# EasyEDA schematic CoffeePID_EDA.json

## Sheets
1 Wemos D1: TITLE: Sheet_1; REV: 1.0; Date: 2022-12-23; Sheet: 1/1; Company: Your Company
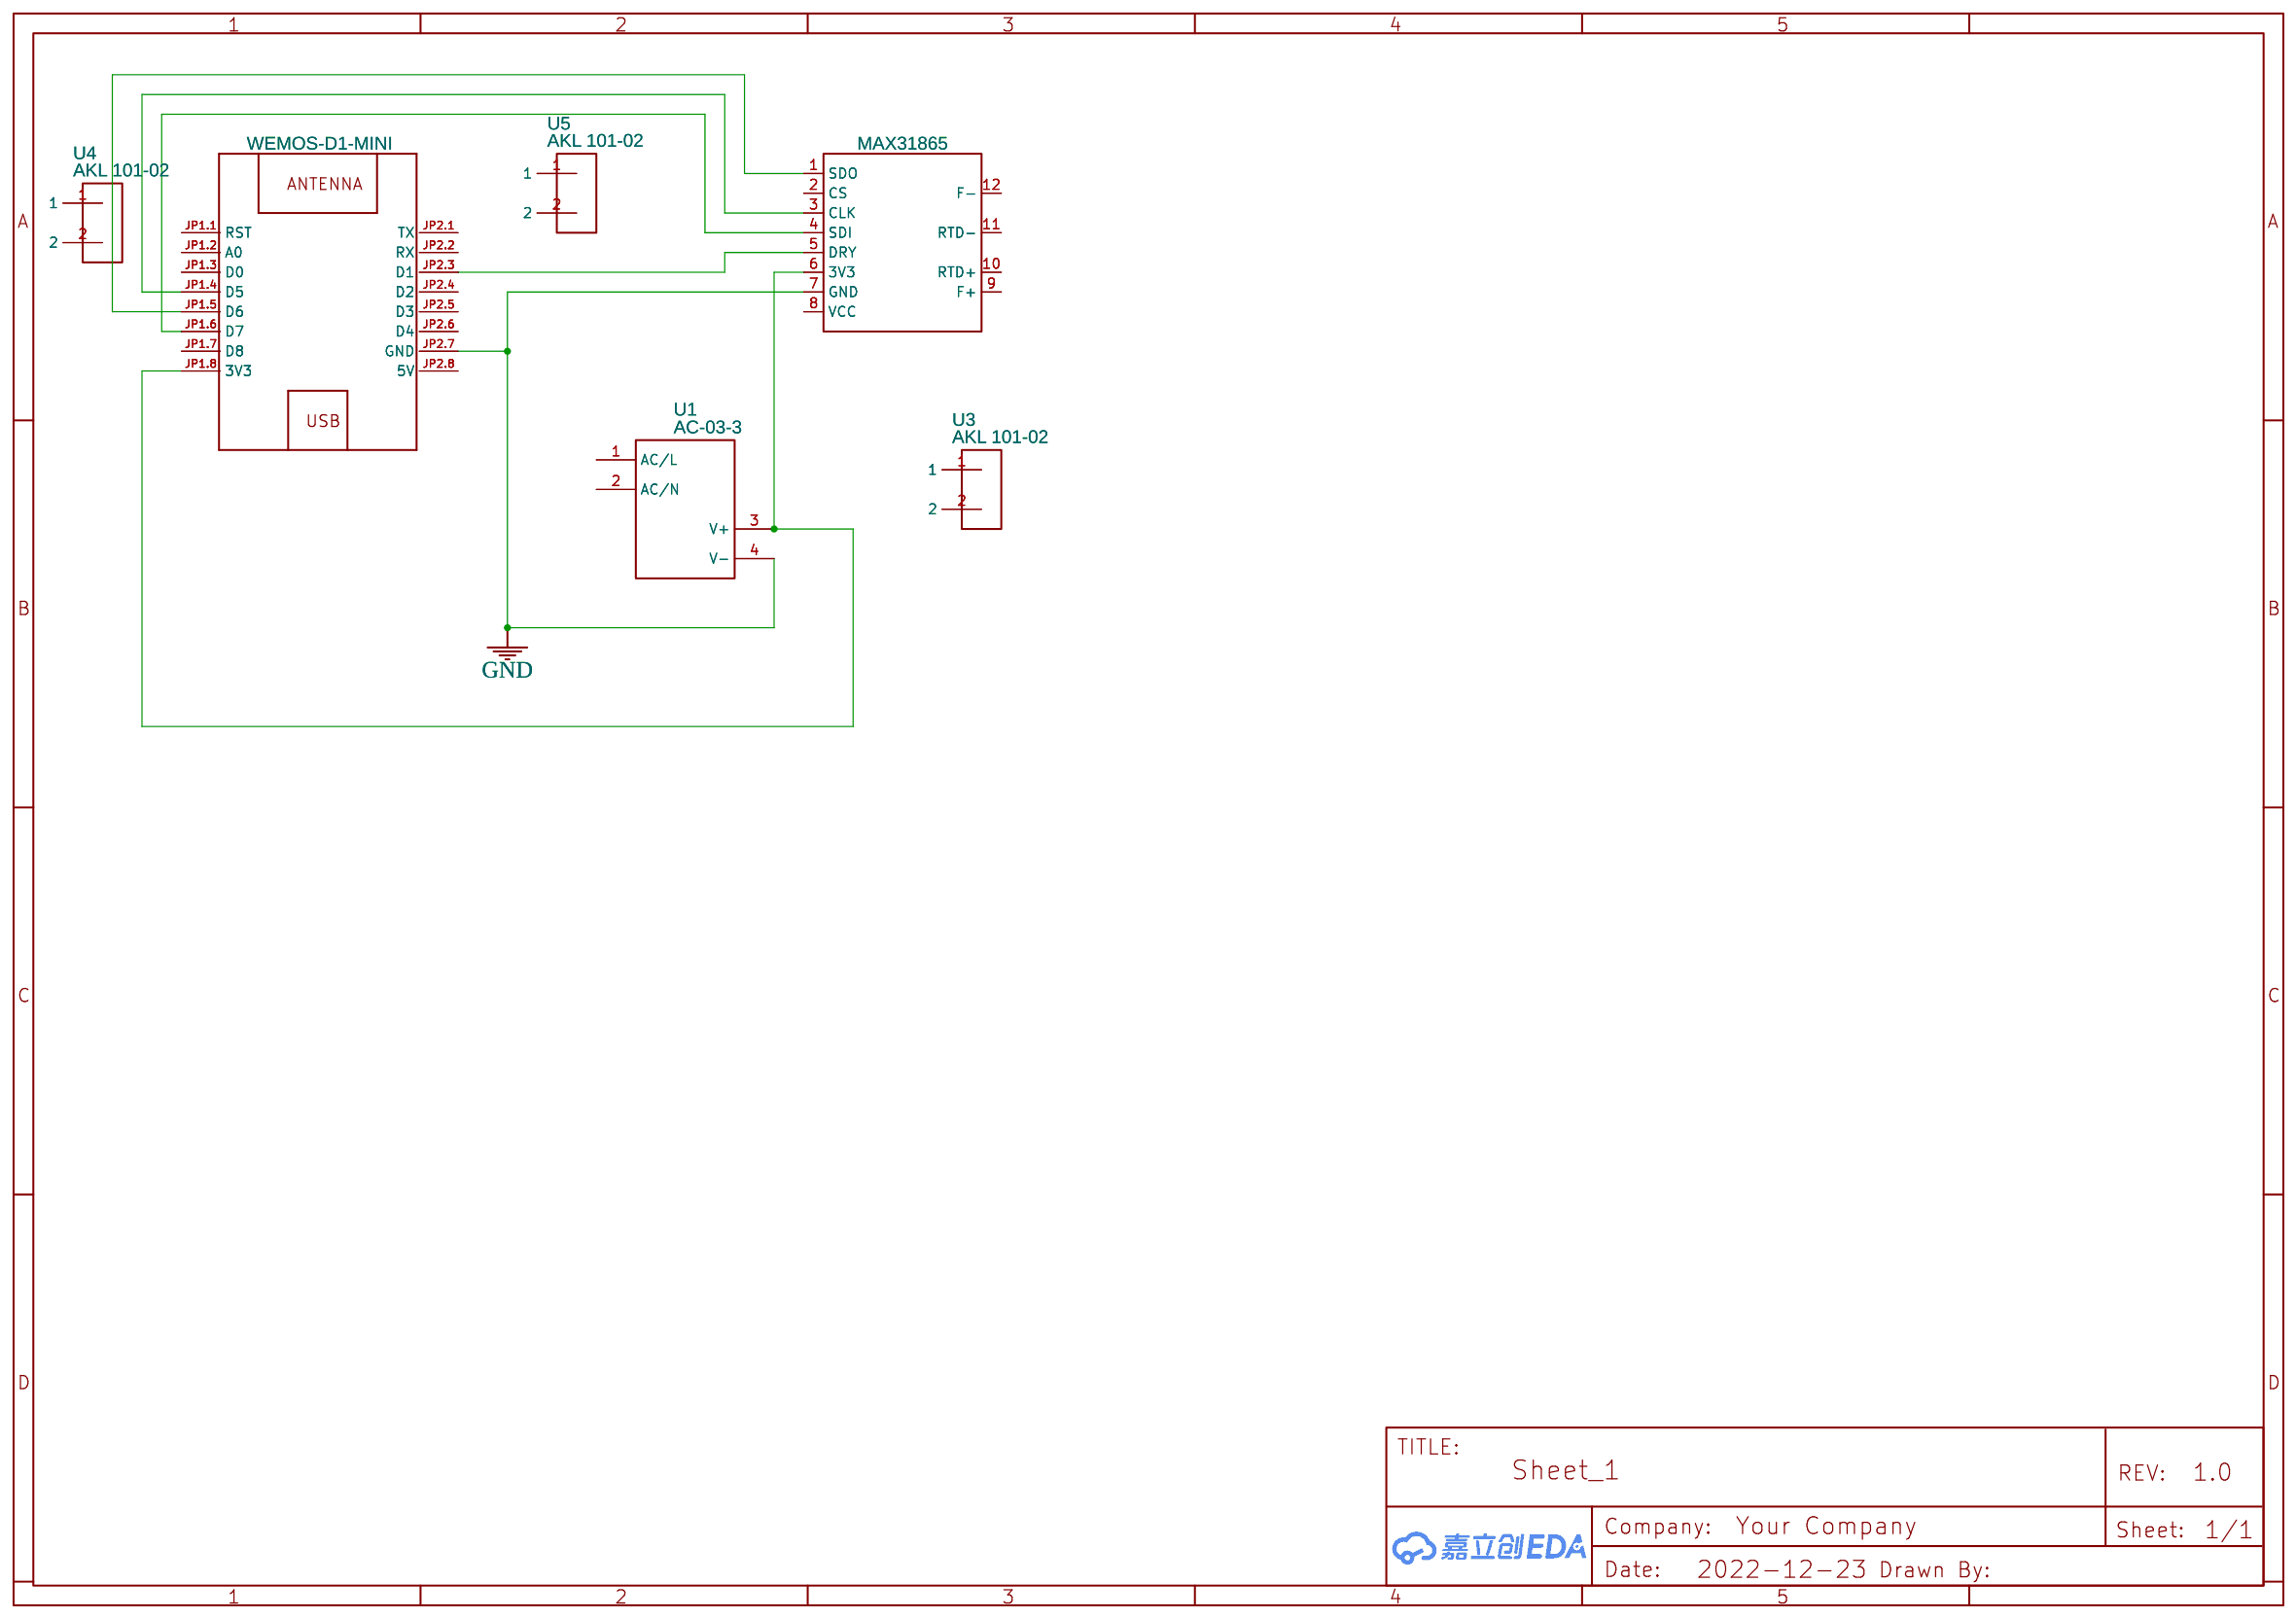
[diagram p0: Wemos D1]
2 NodeMCU: TITLE: Sheet_2; Date: 2023-01-08
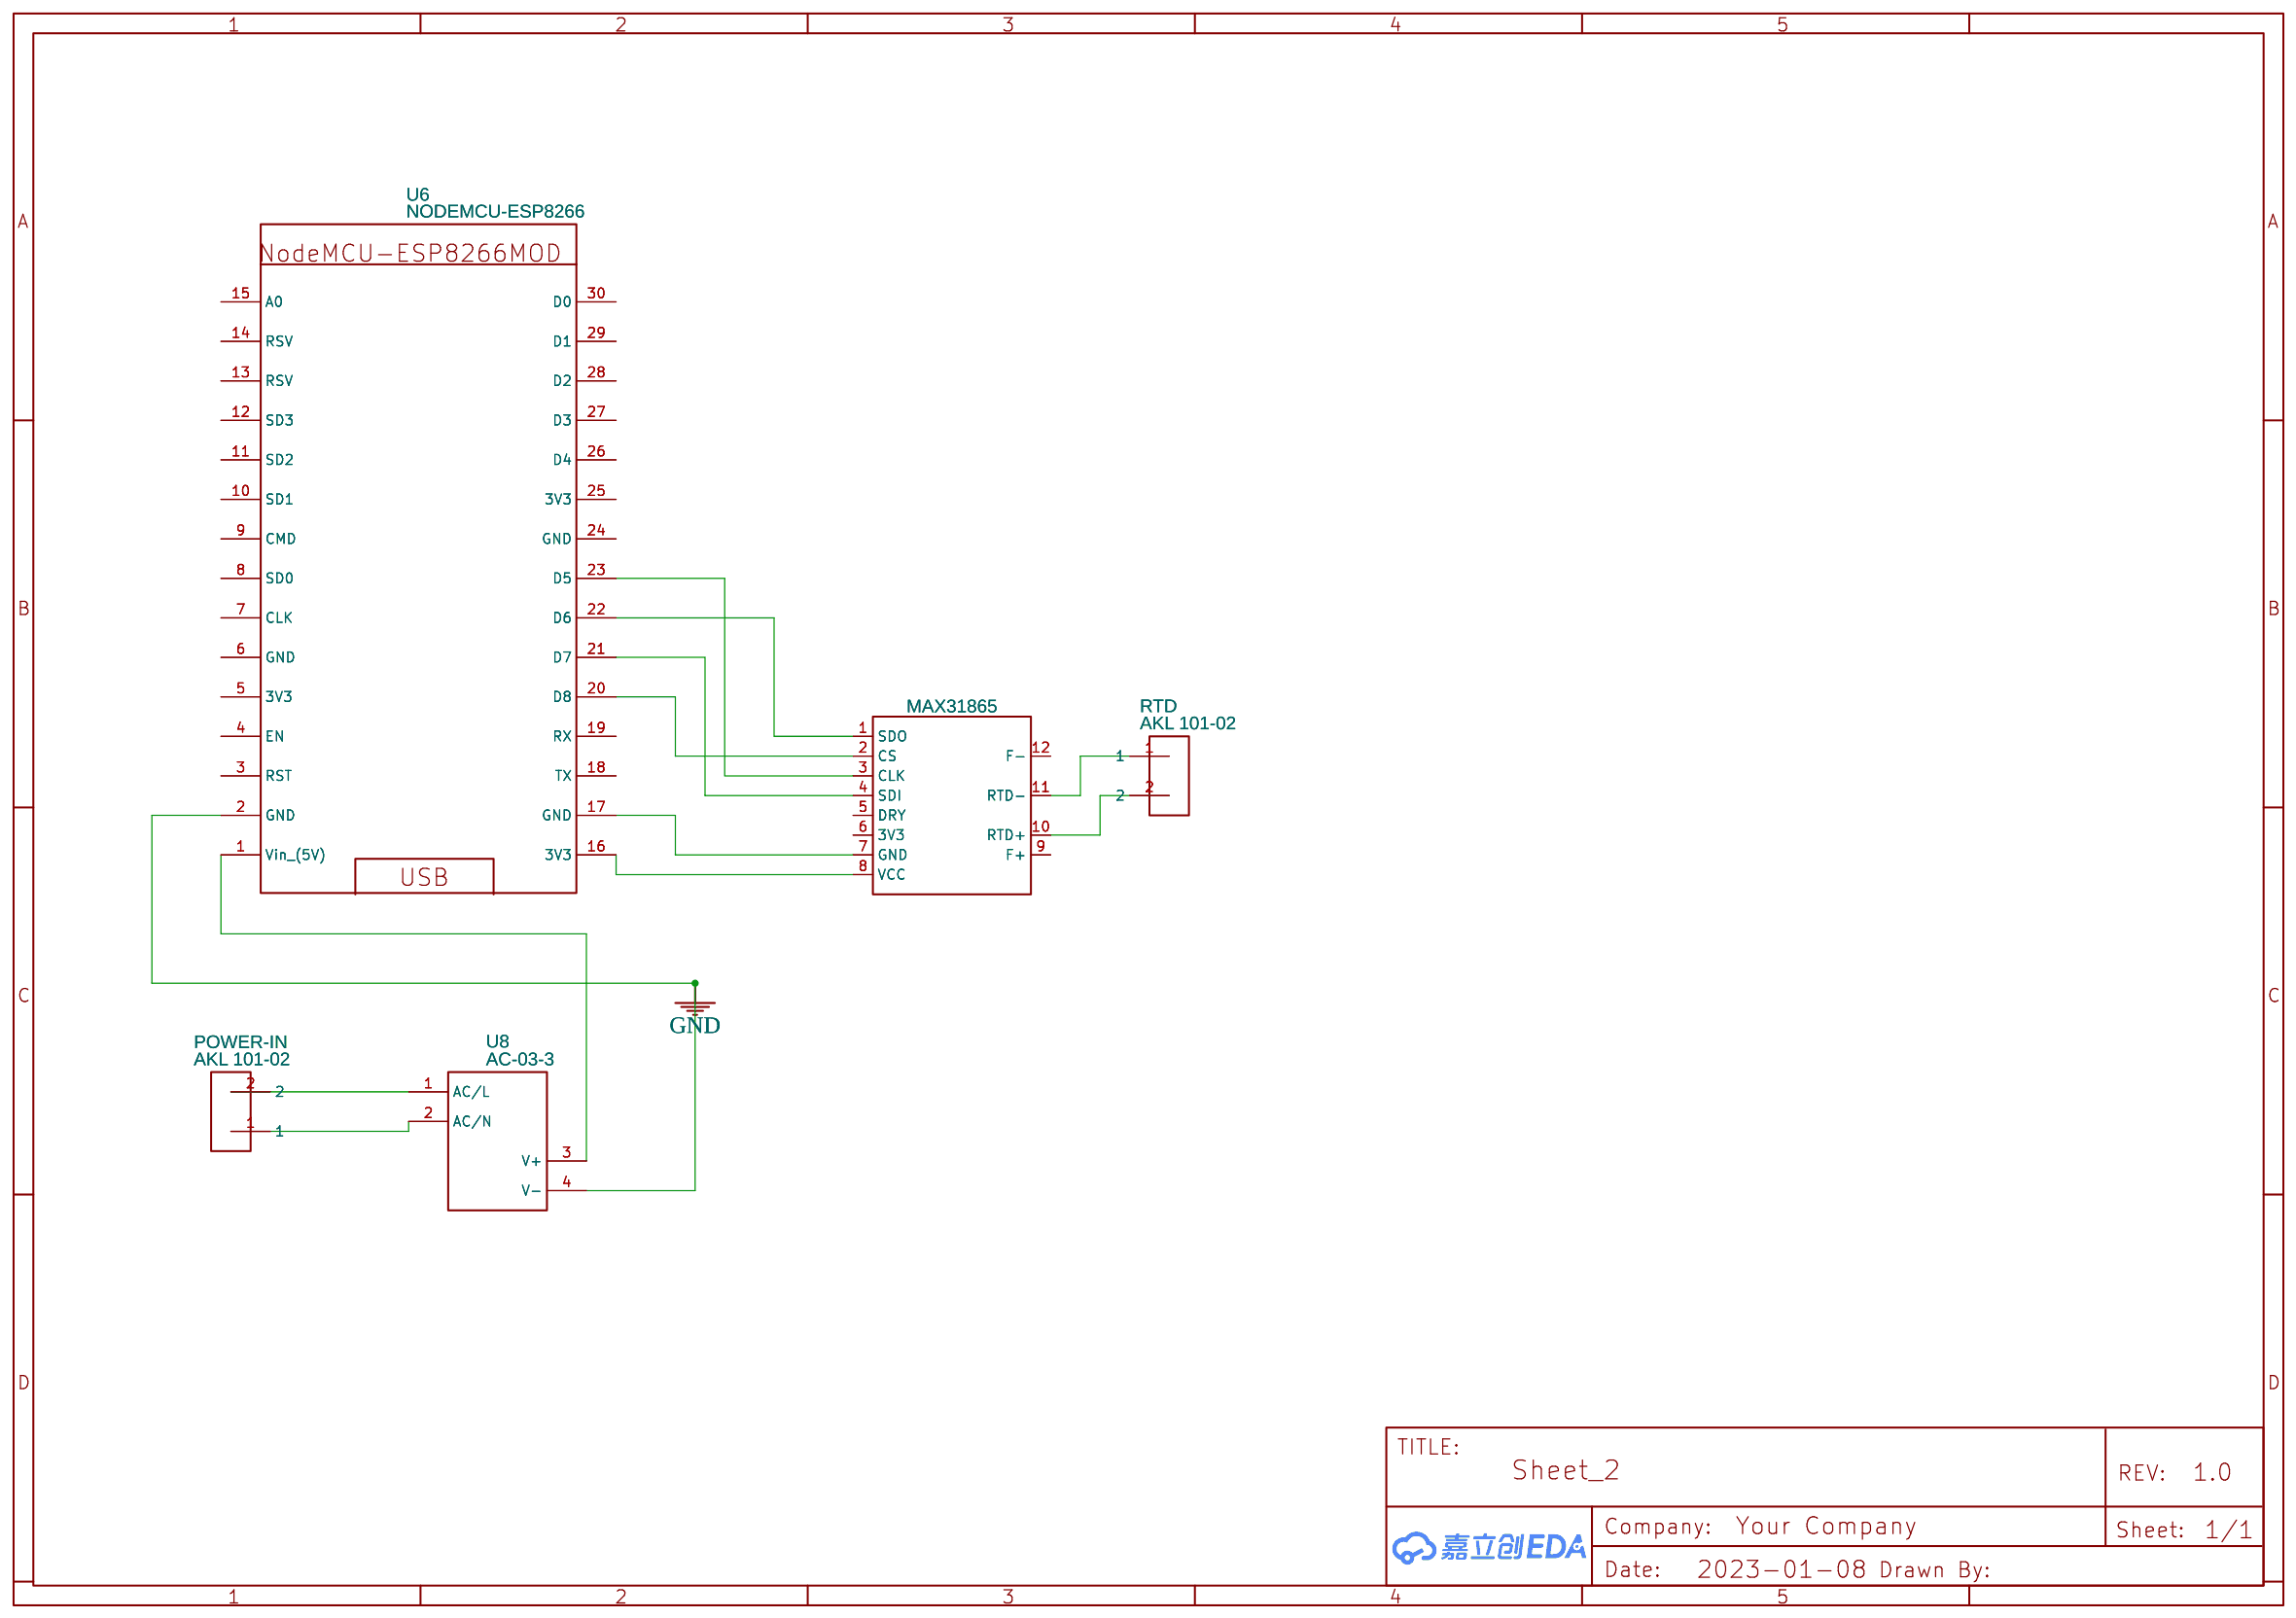
[diagram p1: NodeMCU]

## Parts
sheet NodeMCU
POWER-IN  AKL 101-02  [AKL 101-02]
RTD  AKL 101-02  [AKL 101-02]
U6  NODEMCU-ESP8266  [NODEMCU-ESP8266MOD]
U8  AC-03-3  [AC-03-3 FOOTPRINT]
U9  MAX31865  [MAX31865_MODULE]
sheet Wemos D1
1  WEMOS-D1-MINI  [WEMOS-D1-MINI]
U1  AC-03-3  [AC-03-3 FOOTPRINT]
U2  MAX31865  [MAX31865_MODULE]
U3  AKL 101-02  [AKL 101-02]
U4  AKL 101-02  [AKL 101-02]
U5  AKL 101-02  [AKL 101-02]

## Library data of the parts
POWER-IN RTD U3-U5 = AKL 101-02: Contributor: DVW03
U6 = NODEMCU-ESP8266: Supplier: LCSC; Supplier Part: C111436; Manufacturer: Ai-Thinker; Manufacturer Part: NodeMCU-8266; Contributor: Алексей Крикоров; link: https://lcsc.com/product-detail/Modules_NodeMCU-32S-Lua_C111436.html
U1 U8 = AC-03-3: Manufacturer: AZDelivery; Manufacturer Part: B07C4THP6G; Supplier: Amazon; Supplier Part: ‎ 3x 220 V vers 3.3 V; link: https://www.amazon.de/AZDelivery-220V-Mini-Netzteil-Arduino-Raspberry/dp/B07C4THP6G/ref=sr_1_2?__mk_de_DE=%C3%85M%C3%85%C5%BD%C3%95%C3%91&keywords=230%2Bac%2B3.3%2Bdc&qid=1639147049&sr=8-2&th=1; Contributor: mail_1660
U2 U9 = MAX31865: Contributor: pt100
1 = WEMOS-D1-MINI: Contributor: nicsakegy

## Nets
GND: 1.JP2.7(GND) U1.4(V-) U2.7(GND) U6.2(GND) U8.4(V-)
Net-(1-JP1.4): 1.JP1.4(D5) U2.3(CLK)
Net-(1-JP1.5): 1.JP1.5(D6) U2.1(SDO)
Net-(1-JP1.6): 1.JP1.6(D7) U2.4(SDI)
Net-(1-JP1.8): 1.JP1.8(3V3) U1.3(V+) U2.6(3V3)
Net-(1-JP2.3): 1.JP2.3(D1) U2.5(DRY)
Net-(POWER-IN-1): POWER-IN.1 U8.2(AC/N)
Net-(POWER-IN-2): POWER-IN.2 U8.1(AC/L)
Net-(RTD-1): RTD.1 U9.11(RTD-)
Net-(RTD-2): RTD.2 U9.10(RTD+)
Net-(U6-1): U6.1(Vin (5V)) U8.3(V+)
Net-(U6-16): U6.16(3V3) U9.8(VCC)
Net-(U6-17): U6.17(GND) U9.7(GND)
Net-(U6-20): U6.20(D8) U9.2(CS)
Net-(U6-21): U6.21(D7) U9.4(SDI)
Net-(U6-22): U6.22(D6) U9.1(SDO)
Net-(U6-23): U6.23(D5) U9.3(CLK)

Not connected (* = marked no-connect by the designer): 1 JP1.1(RST) JP1.2(A0) JP1.3(D0) JP1.7(D8) JP2.1(TX) JP2.2(RX) JP2.4(D2) JP2.5(D3) JP2.6(D4) JP2.8(5V); U1 1(AC/L) 2(AC/N); U2 2(CS) 8(VCC) 9(F+) 10(RTD+) 11(RTD-) 12(F-); U3 1 2; U4 1 2; U5 1 2; U6 3(RST) 4(EN) 5(3V3) 6(GND) 7(CLK) 8(SD0) 9(CMD) 10(SD1) 11(SD2) 12(SD3) 13(RSV) 14(RSV) 15(A0) 18(TX) 19(RX) 24(GND) 25(3V3) 26(D4) 27(D3) 28(D2) 29(D1) 30(D0); U9 5(DRY) 6(3V3) 9(F+) 12(F-)
